# EAGLE design Planta_2 subamortiguada (EAGLE 7.6.0)
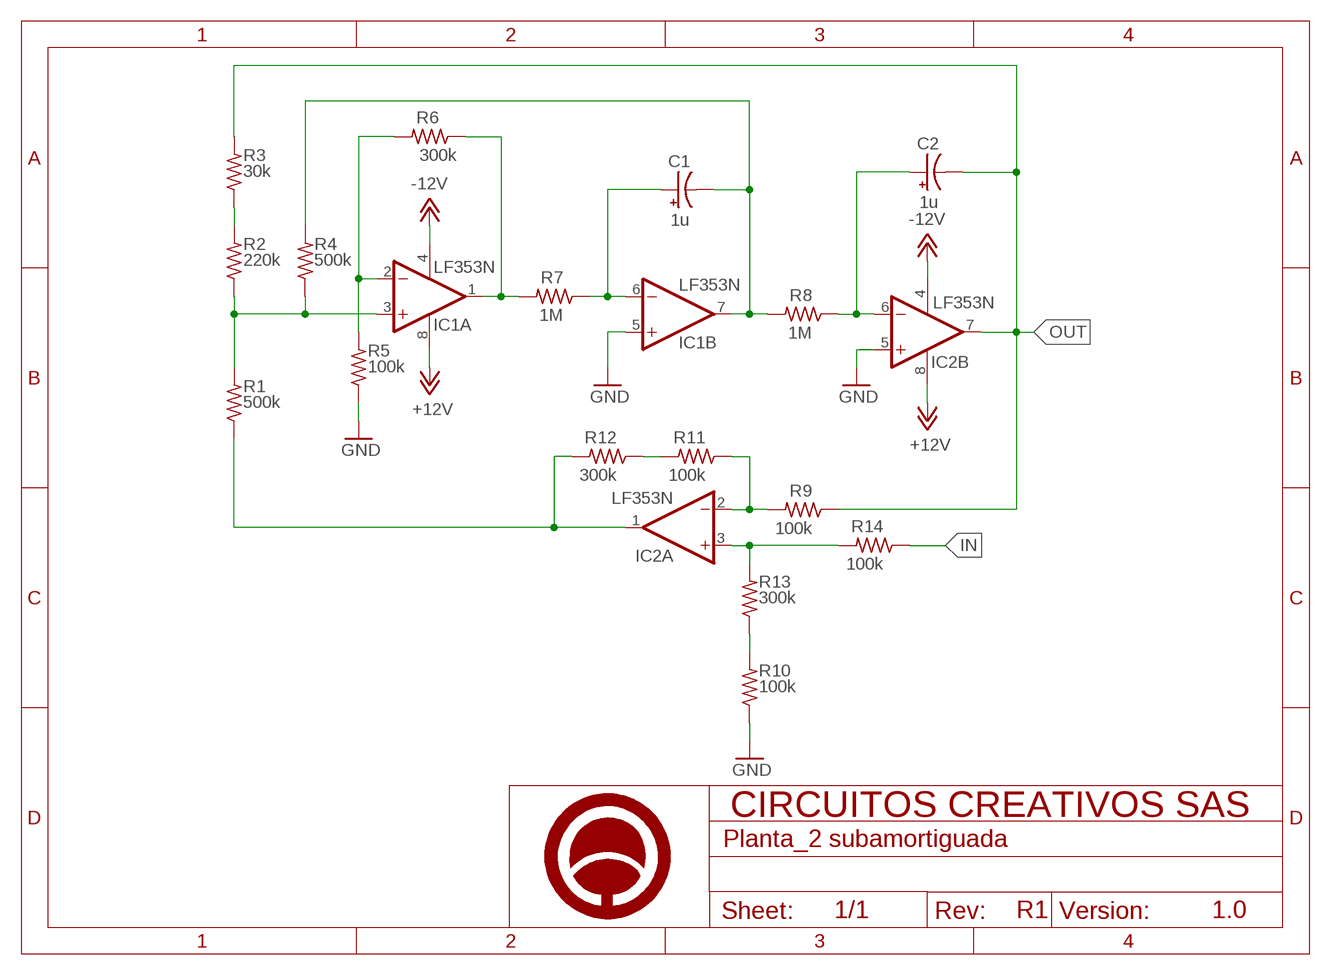
[diagram p0: schematic, sheet 1]

## Parts
C1  1u  CPOL-USE2-5  [E2-5]
C2  1u  CPOL-USE2-5  [E2-5]
F1  A5_HORIZONTAL  [LOGO]
IC1  LF353N  [DIL08]
IC2  LF353N  [DIL08]
R1  500k  R-US_0204/7  [0204/7]
R2  220k  R-US_0204/7  [0204/7]
R3  30k  R-US_0204/7  [0204/7]
R4  500k  R-US_0204/7  [0204/7]
R5  100k  R-US_0204/7  [0204/7]
R6  300k  R-US_0204/7  [0204/7]
R7  1M  R-US_0204/7  [0204/7]
R8  1M  R-US_0204/7  [0204/7]
R9  100k  R-US_0204/7  [0204/7]
R10  100k  R-US_0204/7  [0204/7]
R11  100k  R-US_0204/7  [0204/7]
R12  300k  R-US_0204/7  [0204/7]
R13  300k  R-US_0204/7  [0204/7]
R14  100k  R-US_0204/7  [0204/7]

## Nets
+12V: IC1.8(P:V+) IC2.8(P:V+)
-12V: IC1.4(P:V-) IC2.4(P:V-)
GND: IC1.5(B:+IN) IC2.5(B:+IN) R5.1 R10.1
IN: R14.1
N$1: IC1.3(A:+IN) R1.2 R2.1 R4.1
N$2: R2.2 R3.1
N$3: IC1.2(A:-IN) R5.2 R6.2
N$4: IC1.1(A:OUT) R6.1 R7.2
N$5: C1.+ IC1.6(B:-IN) R7.1
N$6: C1.- IC1.7(B:OUT) R4.2 R8.2
N$7: C2.+ IC2.6(B:-IN) R8.1
N$8: IC2.2(A:-IN) R9.2 R11.1
N$9: IC2.1(A:OUT) R1.1 R12.2
N$10: R11.2 R12.1
N$11: R10.2 R13.1
N$12: IC2.3(A:+IN) R13.2 R14.2
OUT: C2.- IC2.7(B:OUT) R3.2 R9.1

## Notes on the sheet
- R1 | 1.0

## Library data of the parts
C1 C2 = rcl:CPOL-US: POLARIZED CAPACITOR, American symbol
F1 = Circuitos-Creativos-Estilos:A5_HORIZONTAL
IC1 IC2 = linear:LF353: OP AMP
R1-R14 = rcl:R-US_: RESISTOR, American symbol

## Board
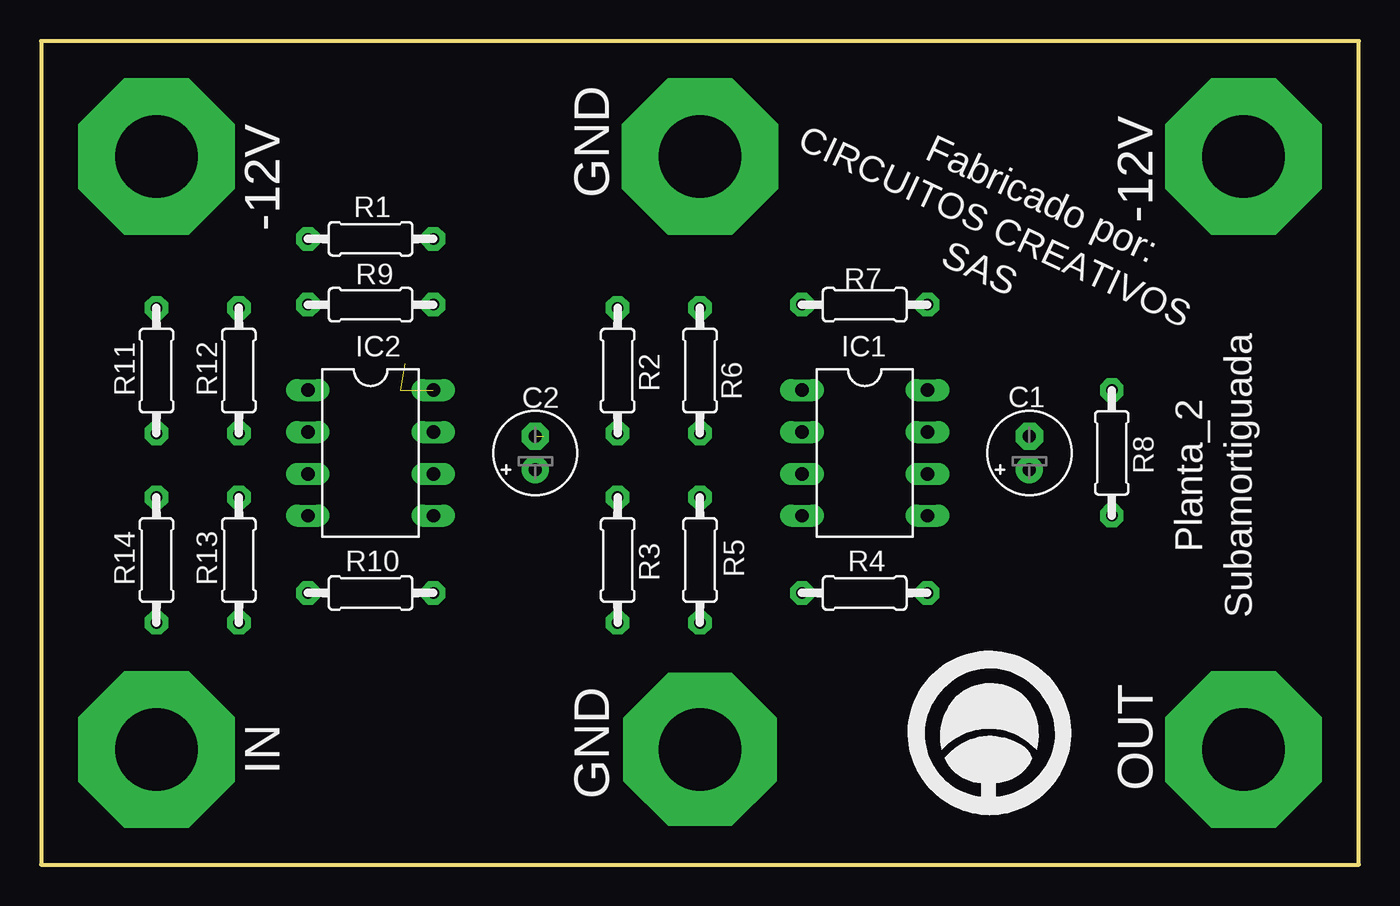
[diagram p1: board, top side]
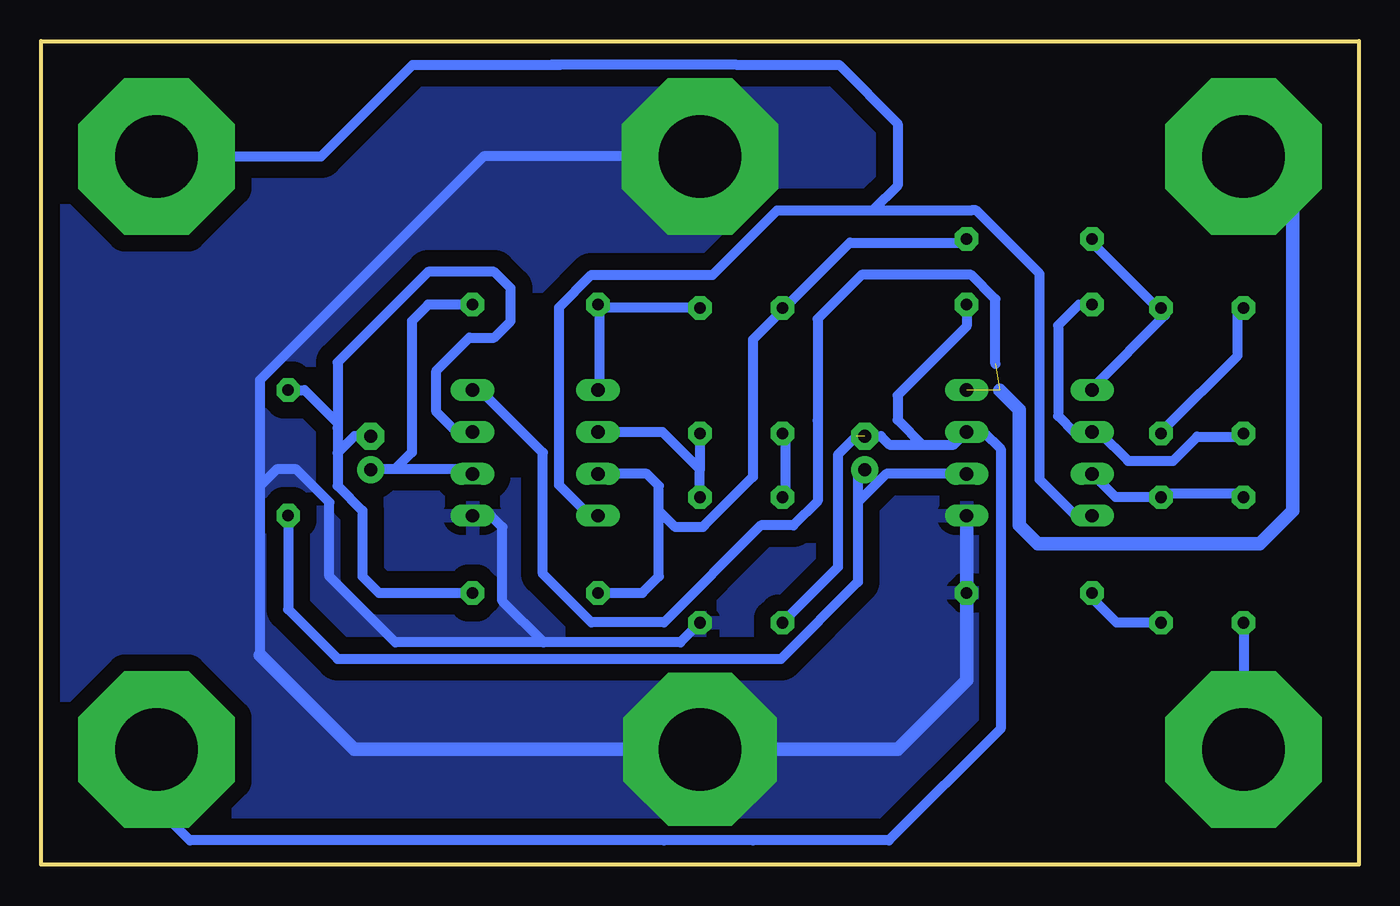
[diagram p2: board, bottom side, seen from below]

Size 80 x 50 mm. Coordinates in mm from the lower left corner, seen from the top.
Outline: 0,0 80,0 80,50 0,50 0,0
Copper layers (1*16): Top 0.035mm / dielectric 1.5mm / Bottom 0.035mm
Design rules "DRC_Serigrafia_1capa *": minimum track width 0.6mm, minimum drill 0.6mm, track to track 15mil, track to pad 15mil, pad to pad 15mil, via to via 15mil, smd to smd 10mil, copper to edge 1mm, drill to drill 15mil, minimum pad ring 10mil, minimum via ring 8mil, stop-mask expansion 4mil, vias tented up to drill 0mil, thermal gap 20mil

### Footprints (pad centres in the part's own frame; a part is rotated, then mirrored left to right if it is on the bottom)
E2-5 = drill 0.8 pad 1.65: + -1.016,0 | drill 0.8 pad 1.65 octagon: - 1.016,0
DIL08 = drill 0.813 pad 1.27 long: 1 -3.81,-3.81; 2 -1.27,-3.81; 3 1.27,-3.81; 4 3.81,-3.81; 5 3.81,3.81; 6 1.27,3.81; 7 -1.27,3.81; 8 -3.81,3.81
0204/7 = drill 0.7 pad 1.422 octagon: 1 -3.81,0; 2 3.81,0

### Placement (x,y rotation side)
C1  60,25 90 top
C2  30,25 90 top
F1  57.57,8 0 top
IC1  50,25 270 top
IC2  20,25 270 top
R1  20,38 0 top
R2  35,30 270 top
R3  35,18.5 270 top
R4  50,16.5 0 top
R5  40,18.5 90 top
R6  40,30 270 top
R7  50,34 180 top
R8  65,25 90 top
R9  20,34 180 top
R10  20,16.5 180 top
R11  7,30 90 top
R12  12,30 90 top
R13  12,18.5 90 top
R14  7,18.5 90 top

### Tracks (layer width: path | path; a pad name or v marks a point on that pad's centre or on a via)
+12V  (via drill 5 pad 9.5)  (2 unrouted)
  Bottom 0.6: 32.86,26.98 32.86,22.07 34.34,20.6 36.3,20.6 42.18,14.71 46.6,14.71 49.54,17.66 49.54,25.02 52.97,28.45 53.47,28.45 IC1.8 | 23.54,35.81 22.07,34.34 22.07,30.41
  Bottom 0.61: 23.54,35.81 30.19,35.81 32.86,33.14 32.86,26.98
  Bottom 0.813: v7,43 4,40 4,21.5 6,19.5 19.5,19.5 20.62,20.62 20.62,27.62 21.81,28.81
-12V  (via drill 5 pad 9.5)
  Bottom 0.6: 23.54,39.73 28,39.73 29.5,39.73 35.32,39.73 39.24,35.81 46.6,35.81 48.56,33.84 48.56,23.05 46.6,21.09 IC1.4 | 37.77,48.56 48.5,48.56 49.05,48.56
  Bottom 0.61: IC2.4 17.19,21.19 19.38,23.38 19.38,35.88 23.23,39.73 23.54,39.73 | 28.94,39.73 28,39.73 | v73,43 63,43 57.44,48.56 48.5,48.56 | 37.77,48.56 31.56,48.56 28,45 28,41.23 29.5,39.73
GND  (via drill 5 pad 9.3, 5 pad 9.5)
  Bottom 0.6: 53.47,42.67 53.82,42.32 66.71,29.43 66.71,26.98
  Bottom 0.61: v40,43 53.14,43 53.82,42.32 | 66.71,12.71 66.71,23 | 66.71,23 66.71,26.98 | R5.1 41.19,13.5 49.5,13.5 | 49.5,13.5 58.5,13.5 62.5,17.5 62.5,22 64.5,24 65.71,24 66.71,23 | IC1.5 52.69,21.19 52,20.5 52,16 49.5,13.5
  Bottom 0.813: IC2.5 R10.1 23.81,11.19 28,7 v40,7 61,7 66.71,12.71
  pour Bottom (isolate 1.016): -1,-1 81,-1 81,51 -1,51
IN  (via drill 5 pad 9.5)
  Bottom 0.61: R14.1 v7,7
N$1
  Bottom 0.6: R1.2 24.04,37.77 30.9,37.77 34.83,33.84 R2.1 35.32,33.35 36.79,31.88 36.79,23.54 39.73,20.6
  Bottom 0.61: 39.73,20.6 39.83,20.5 41.5,20.5 42.5,21.5 | 42.5,21.5 42.5,23 43.23,23.73 IC1.3 | R4.1 43.5,16.5 42.5,17.5 42.5,21.5
N$2
  Bottom 0.6: R3.1 34.83,22.56 34.83,26 R2.2
N$3
  Bottom 0.61: R5.2 40,24 | 40,24 42.27,26.27 IC1.2 | R6.2 40,24
N$4
  Bottom 0.6: 46.11,33.84 46.11,28.94 IC1.1 | 46.11,33.84 40.22,33.84 R6.1 | 46.11,33.84 R7.2
N$5
  Bottom 0.6: IC1.6 53.95,24.04 58.5,24.04 59.84,24.04 C1.+
  Bottom 0.61: R7.1 56.5,34 57.5,33 57.5,25.04 58.5,24.04
N$6
  Bottom 0.61: C1.- 60.98,26.02 62,25 | 62,26.81 62,26.5 62,25 | 62,25 62,23 60.5,21.5 60.5,17.5 59.5,16.5 R4.2 | R8.2 64,28.81 62,26.81 | IC1.7 54.77,26.27 56,27.5 56,30 54,32 52.5,32 51.5,33 51.5,35 52.5,36 56.5,36 62,30.5 62,26.81
N$7
  Bottom 0.6: 30.41,17.17 30.41,22 30.41,23.54 C2.+
  Bottom 0.61: IC2.6 28.68,23.73 30.41,22 | R8.1 65,15.5 62,12.5 35.08,12.5 30.41,17.17
N$8
  Bottom 0.6: 14,24.52 11.28,24.52 9.81,26 7.36,26 R11.1
  Bottom 0.61: R9.2 17,34 18.25,32.75 18.25,27.25 17.27,26.27 IC2.2 15.74,26.27 14,24.52
N$9
  Bottom 0.6: IC2.1 16.19,28.94 11.77,33.35 R12.2 12.26,33.84 16.19,37.77 R1.1
N$10
  Bottom 0.6: R11.2 7.36,33.35 7.36,30.9 11.77,26.49 R12.1
N$11
  Bottom 0.6: R13.1 12.26,14.71 14.71,14.71 16.19,16.19 R10.2
N$12
  Bottom 0.6: R14.2 7.36,22.56 11.77,22.56 R13.2
  Bottom 0.61: R13.2 14.77,22.31 IC2.3
OUT  (via drill 5 pad 9.5)  (1 unrouted)
  Bottom 0.6: 36.79,1.47 42.18,1.47
  Bottom 0.61: 36.79,1.47 28.53,1.47 21.75,8.25 21.75,25.25 22.77,26.27 IC2.7 24.58,25.5 26.5,25.5 | 42.18,1.47 70.97,1.47 73,3.5 v73,7 | C2.- 29.02,26.02 28.5,25.5 26.5,25.5 | R9.1 23.81,32.69 28,28.5 28,27 26.5,25.5 | 30.5,26 31.62,24.88 31.62,18.07 R3.2

### Text on the board
tPlace: GND | -12V | -12V | Fabricado por: | SAS | CIRCUITOS CREATIVOS | Planta_2 | Subamortiguada | IN | GND | OUT